# Altium schematic sheet TimeCompare.SchDoc: LiveDesign Evaluation - Alarm Clock
size A4; Organization: Altium Limited; Address1: L3, 12a Rodborough Rd; Address2: Frenchs Forest; Address3: NSW; Address4: Australia 2086; DocumentNumber: 3; SheetNumber: 3; SheetTotal: 10
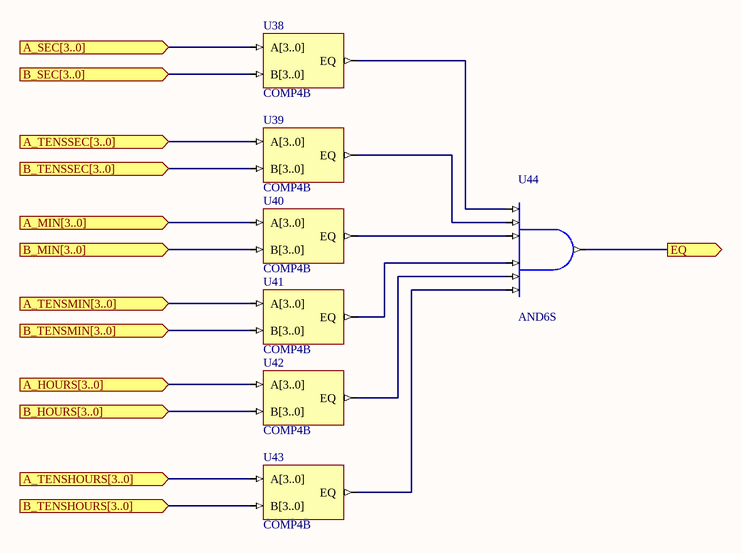
[diagram p0: TimeCompare.SchDoc]

## Parts
U38  COMP4B
U39  COMP4B
U40  COMP4B
U41  COMP4B
U42  COMP4B
U43  COMP4B
U44  AND6S

## Ports
A_HOURS[3..0] (in), A_MIN[3..0] (in), A_SEC[3..0] (in), A_TENSHOURS[3..0] (in), A_TENSMIN[3..0] (in), A_TENSSEC[3..0] (in), B_HOURS[3..0] (in), B_MIN[3..0] (in), B_SEC[3..0] (in), B_TENSHOURS[3..0] (in), B_TENSMIN[3..0] (in), B_TENSSEC[3..0] (in), EQ (out)

## Nets
A_HOURS[3..0]: U42.A[3..0] ; port A_HOURS[3..0]
A_MIN[3..0]: U40.A[3..0] ; port A_MIN[3..0]
A_SEC[3..0]: U38.A[3..0] ; port A_SEC[3..0]
A_TENSHOURS[3..0]: U43.A[3..0] ; port A_TENSHOURS[3..0]
A_TENSMIN[3..0]: U41.A[3..0] ; port A_TENSMIN[3..0]
A_TENSSEC[3..0]: U39.A[3..0] ; port A_TENSSEC[3..0]
B_HOURS[3..0]: U42.B[3..0] ; port B_HOURS[3..0]
B_MIN[3..0]: U40.B[3..0] ; port B_MIN[3..0]
B_SEC[3..0]: U38.B[3..0] ; port B_SEC[3..0]
B_TENSHOURS[3..0]: U43.B[3..0] ; port B_TENSHOURS[3..0]
B_TENSMIN[3..0]: U41.B[3..0] ; port B_TENSMIN[3..0]
B_TENSSEC[3..0]: U39.B[3..0] ; port B_TENSSEC[3..0]
EQ: U44.O ; port EQ
NetU38_EQ: U38.EQ U44.I0
NetU39_EQ: U39.EQ U44.I1
NetU40_EQ: U40.EQ U44.I2
NetU41_EQ: U41.EQ U44.I3
NetU42_EQ: U42.EQ U44.I4
NetU43_EQ: U43.EQ U44.I5

## Notes on the sheet
- Title
- Size:
- Date:
- A4
- Number:
- Time:
- Revision:
- Sheet
- of
- File:

## Library data of the parts
U38-U43 = COMP4B: 4-Bit Identity Comparator, Bus Version; ArchiveName: GENERIC; VHDLIB_SIM: GENERIC_LIB; Published: 29-Jan-2004; Publisher: Altium Limited; Core Revision: 1.00.00
U44 = AND6S: 6-Input AND Gate, Single Pin Version; Xilinx Equivalent: AND6; ArchiveName: GENERIC; VHDLIB_SIM: GENERIC_LIB; Published: 29-Jan-2004; Publisher: Altium Limited; Core Revision: 1.00.00